# Altium schematic sheet coil_if.SchDoc: =ProjectName+'_'+ProjectRevision+'_'+VariantName
size A3; DocumentNumber: 3; SheetNumber: 3; SheetTotal: 5
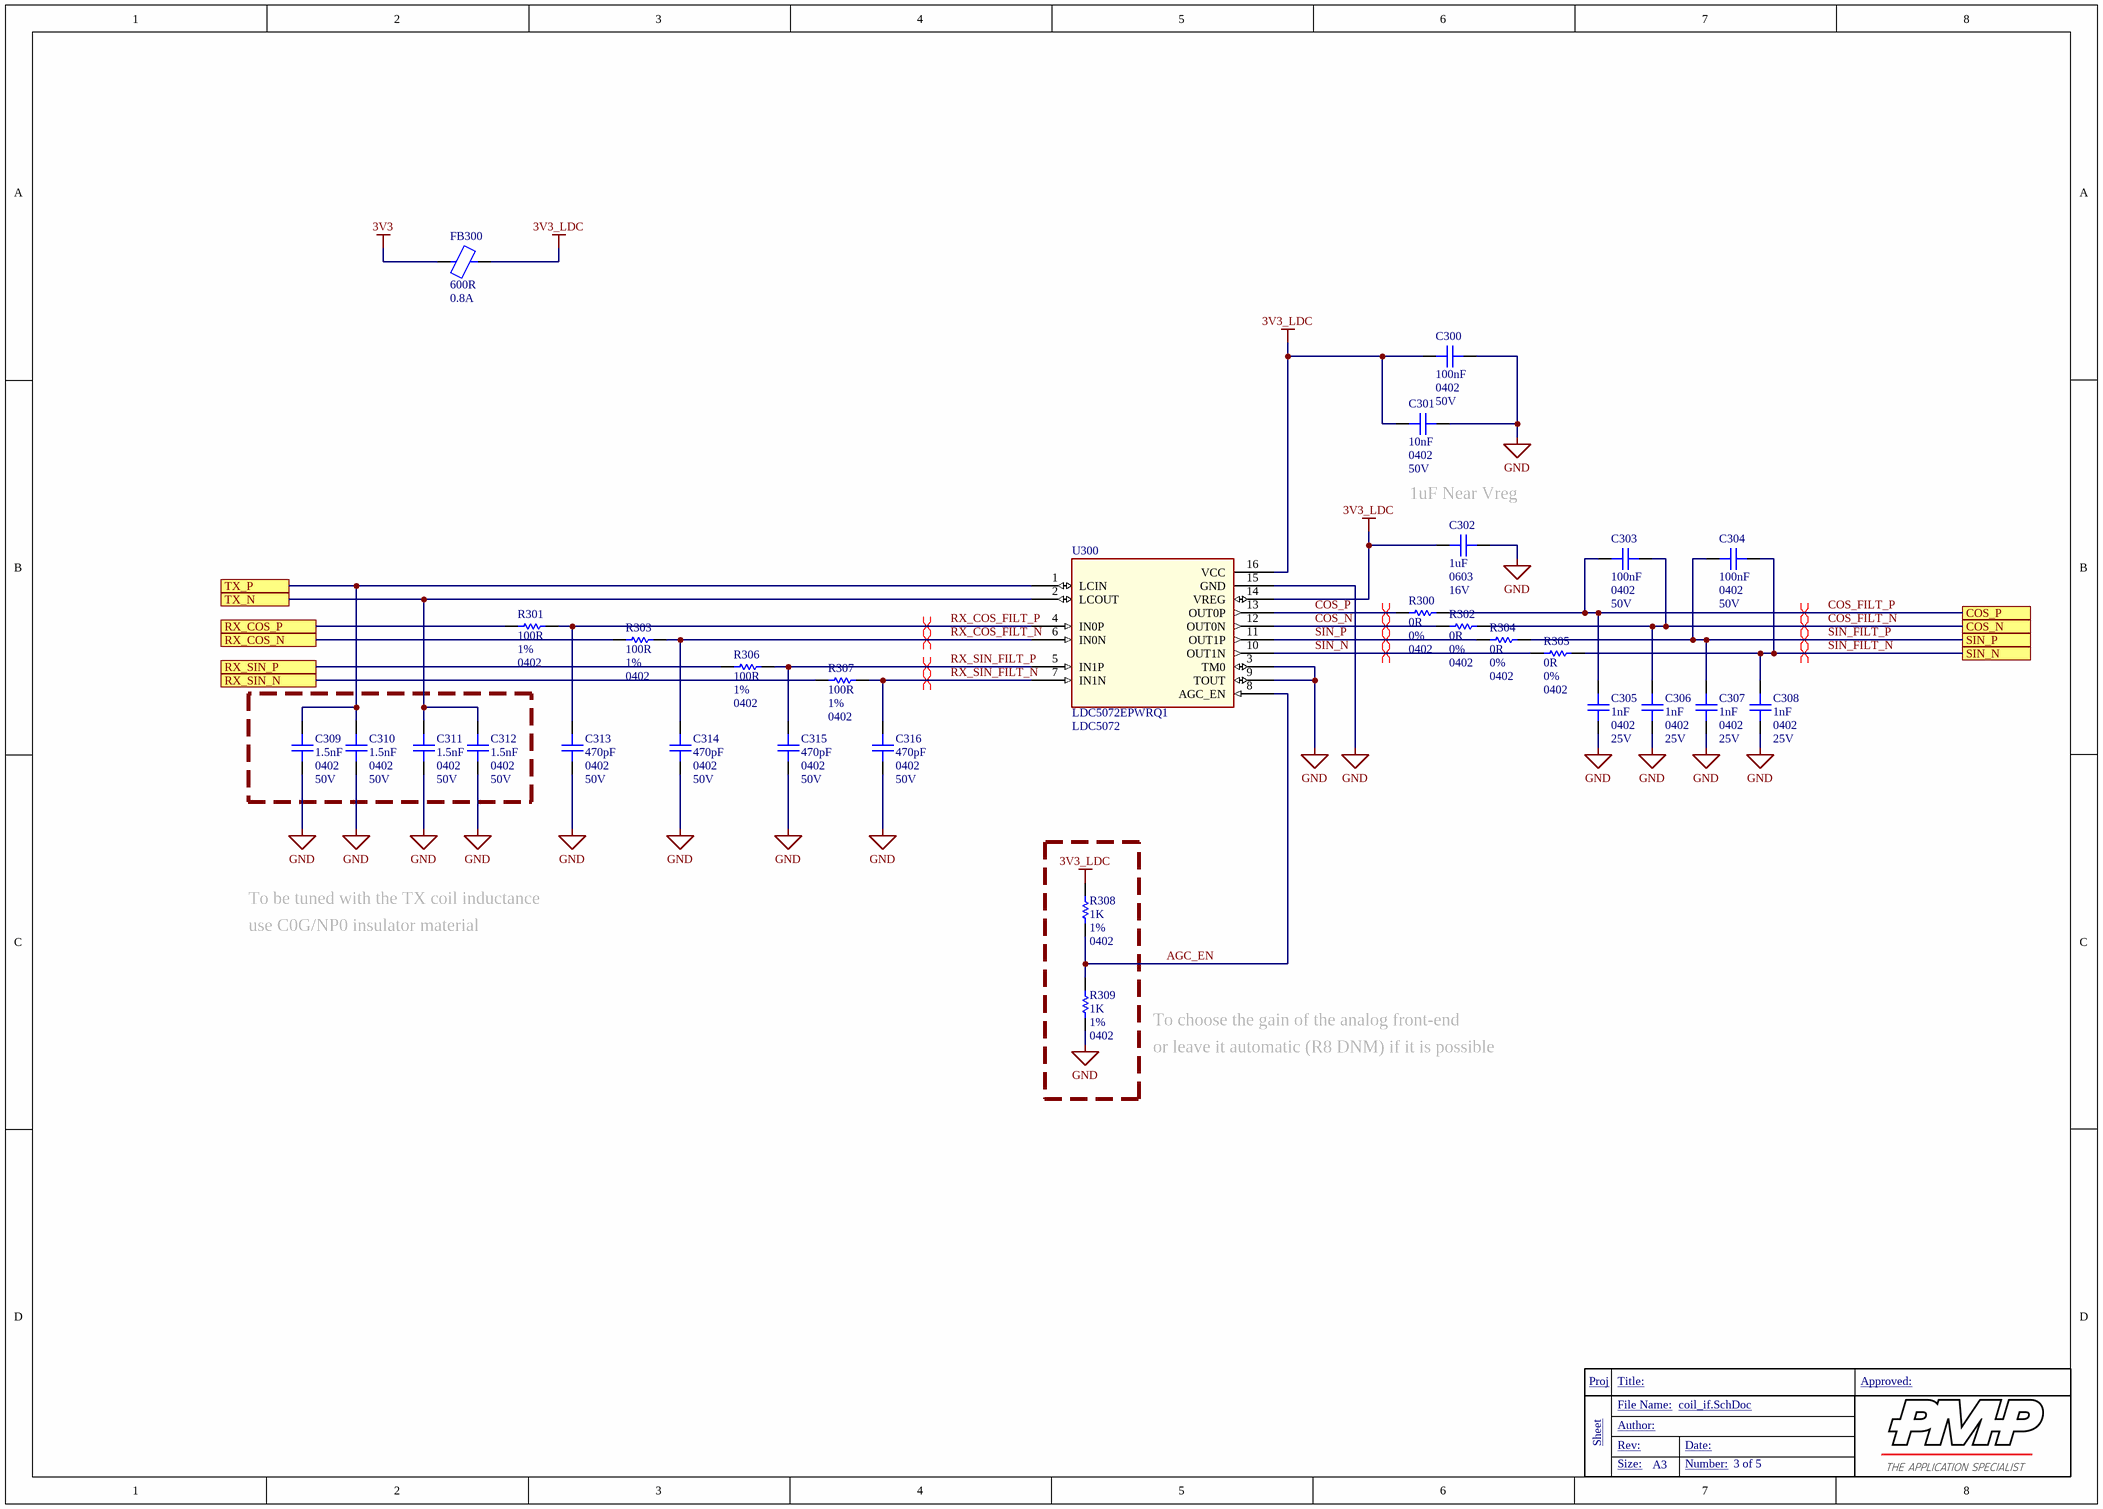
[diagram p0: coil_if.SchDoc]

## Parts
C300  Case/Package: 0402  Op Voltage: 50V  [CER0402]  (hidden comment: 100nF)
C301  Case/Package: 0402  Op Voltage: 50V  [CER0402]  (hidden comment: 10nF)
C302  Case/Package: 0603  Op Voltage: 16V  [CER0603]  (hidden comment: 1uF)
C303  Case/Package: 0402  Op Voltage: 50V  [CER0402]  (hidden comment: 100nF)
C304  Case/Package: 0402  Op Voltage: 50V  [CER0402]  (hidden comment: 100nF)
C305  Case/Package: 0402  Op Voltage: 25V  [CER0402]  (hidden comment: 1nF)
C306  Case/Package: 0402  Op Voltage: 25V  [CER0402]  (hidden comment: 1nF)
C307  Case/Package: 0402  Op Voltage: 25V  [CER0402]  (hidden comment: 1nF)
C308  Case/Package: 0402  Op Voltage: 25V  [CER0402]  (hidden comment: 1nF)
C309  Case/Package: 0402  Op Voltage: 50V  [CER0402]  (hidden comment: 1.5nF)
C310  Case/Package: 0402  Op Voltage: 50V  [CER0402]  (hidden comment: 1.5nF)
C311  Case/Package: 0402  Op Voltage: 50V  [CER0402]  (hidden comment: 1.5nF)
C312  Case/Package: 0402  Op Voltage: 50V  [CER0402]  (hidden comment: 1.5nF)
C313  Case/Package: 0402  Op Voltage: 50V  [CER0402]  (hidden comment: 470pF)
C314  Case/Package: 0402  Op Voltage: 50V  [CER0402]  (hidden comment: 470pF)
C315  Case/Package: 0402  Op Voltage: 50V  [CER0402]  (hidden comment: 470pF)
C316  Case/Package: 0402  Op Voltage: 50V  [CER0402]  (hidden comment: 470pF)
FB300  Impedence @100MHz: 600R  Rated Current @85°C: 0.8A  [FEB0603]
R300  value 0R  Tolerance: 0%  Case/Package: 0402  [Res0402]  (hidden comment: SMD Resistor)
R301  value 100R  Tolerance: 1%  Case/Package: 0402  [Res0402]  (hidden comment: SMD Resistor)
R302  value 0R  Tolerance: 0%  Case/Package: 0402  [Res0402]  (hidden comment: SMD Resistor)
R303  value 100R  Tolerance: 1%  Case/Package: 0402  [Res0402]  (hidden comment: SMD Resistor)
R304  value 0R  Tolerance: 0%  Case/Package: 0402  [Res0402]  (hidden comment: SMD Resistor)
R305  value 0R  Tolerance: 0%  Case/Package: 0402  [Res0402]  (hidden comment: SMD Resistor)
R306  value 100R  Tolerance: 1%  Case/Package: 0402  [Res0402]  (hidden comment: SMD Resistor)
R307  value 100R  Tolerance: 1%  Case/Package: 0402  [Res0402]  (hidden comment: SMD Resistor)
R308  value 1K  Tolerance: 1%  Case/Package: 0402  [Res0402]  (hidden comment: SMD Resistor)
R309  value 1K  Tolerance: 1%  Case/Package: 0402  [Res0402]  (hidden comment: SMD Resistor)
U300  LDC5072EPWRQ1  value LDC5072  [TSSOP16-PW_TEX]

## Ports
COS_N, COS_P, RX_COS_N, RX_COS_P, RX_SIN_N, RX_SIN_P, SIN_N, SIN_P, TX_N, TX_P

## Nets
3V3: FB300.1
3V3_LDC: C300.1 C301.1 C302.1 FB300.2 R308.2 U300.14(VREG) U300.16(VCC)
GND: C300.2 C301.2 C302.2 C305.2 C306.2 C307.2 C308.2 C309.2 C310.2 C311.2 C312.2 C313.2 C314.2 C315.2 C316.2 R309.1 U300.3(TM0) U300.9(TOUT) U300.15(GND)
AGC_EN: R308.1 R309.2 U300.8(AGC_EN)
COS_FILT_N: C303.1 C306.1 R302.2 ; port COS_N
COS_FILT_P: C303.2 C305.1 R300.2 ; port COS_P
COS_N: R302.1 U300.12(OUT0N)
COS_P: R300.1 U300.13(OUT0P)
RX_COS_FILT_N: C314.1 R303.2 U300.6(IN0N)
RX_COS_FILT_P: C313.1 R301.2 U300.4(IN0P)
RX_COS_N: R303.1 ; port RX_COS_N
RX_COS_P: R301.1 ; port RX_COS_P
RX_SIN_FILT_N: C316.1 R307.2 U300.7(IN1N)
RX_SIN_FILT_P: C315.1 R306.2 U300.5(IN1P)
RX_SIN_N: R307.1 ; port RX_SIN_N
RX_SIN_P: R306.1 ; port RX_SIN_P
SIN_FILT_N: C304.1 C308.1 R305.2 ; port SIN_N
SIN_FILT_P: C304.2 C307.1 R304.2 ; port SIN_P
SIN_N: R305.1 U300.10(OUT1N)
SIN_P: R304.1 U300.11(OUT1P)
TX_N: C311.1 C312.1 U300.2(LCOUT) ; port TX_N
TX_P: C309.1 C310.1 U300.1(LCIN) ; port TX_P

## Layout directives
differential pair: COS_FILT_N, COS_FILT_P, COS_N, COS_P, RX_COS_FILT_N, RX_COS_FILT_P, RX_SIN_FILT_N, RX_SIN_FILT_P, SIN_FILT_N, SIN_FILT_P, SIN_N, SIN_P

## Notes on the sheet
- 1uF Near Vreg
- To be tuned with the TX coil inductance
- use C0G/NP0 insulator material
- To choose the gain of the analog front-end
- or leave it automatic (R8 DNM) if it is possible
- Proj
- Title:
- Approved:
- Sheet
- File Name:
- Rev:
- Author:
- Date:
- Size:
- A3
- Number:

## Library data of the parts
C300 C303 C304 = GCM155R71H104KE02D: MLCC Automotive, 100nF, 0402, 50V, 10%, X7r; MFG1: MURATA; Min Op# Temp °C: -55; Max Op# temp °C: 125; Qualification: AEC-Q200; MPN1: GCM155R71H104KE02D; Value: 100nF; MFG2: MURATA; MPN2: GCM155R71H104KE37; Tolerance: 10%; Dielectric: X7R; Supplier: Mouser; Supplier Part Number: 81-GCM155R71H104KE2D; Supplier URL: https://www.mouser.it/ProductDetail/Murata-Electronics/GCM155R71H104KE02D?qs=hNud%2FORuBR2sLZsqfoz4Fw%3D%3D; Datasheet URL: https://www.mouser.it/datasheet/2/281/1/GCM155R71H104KE02_01A-3142168.pdf; Technology: Powertrain/Safety for Automotive
C301 = GCM155R71H103KA55*: MLCC Automotive, 10nF, 0402, 25V, 10%, X7r; MFG1: MURATA; Min Op# Temp °C: -55; Max Op# temp °C: 125; Qualification: AEC-Q200; MPN1: GCM155R71H103KA55*; Value: 10nF; Tolerance: 10%; Dielectric: X7R; Supplier: Mouser; Supplier Part Number: 81-GCM155R71H103KA5J; Supplier URL: https://www.mouser.it/ProductDetail/Murata-Electronics/GCM155R71H103KA55J?qs=N3Kl9KD794RolAwdnyzU1Q%3D%3D; Datasheet URL: https://www.mouser.it/datasheet/2/281/1/GCM155R71H103KA55_01A-3142380.pdf; Technology: Powertrain/Safety for Automotive
C302 = GCM188R71C105KA64J: MLCC Automotive, 1uF, 0603, 16V, 10%, X7R; MFG1: MURATA; Min Op# Temp °C: -55; Max Op# temp °C: 125; Qualification: AEC-Q200; MPN1: GCM188R71C105KA64J; Value: 1uF; MFG2: KEMET; MPN2: C0603C105K4RACAUTO; Tolerance: 10%; Dielectric: X7R; Supplier: Mouser; Supplier Part Number: 81-GCM188R71C105KA4J; Supplier URL: https://www.mouser.it/ProductDetail/Murata-Electronics/GCM188R71C105KA64J?qs=4%252BGqC78dy0BN5WaW5TLgXw%3D%3D; Datasheet URL: https://www.mouser.it/datasheet/2/281/1/GCM188R71C105KA64_04A-3143889.pdf; Technology: Powertrain/Safety for Automotive
C305-C308 = GRT1555C1E102JA02J: MLCC Automotive, 1nF, 0402, 25V, 10%, COG; MFG1: MURATA; Tolerance: 5%; Dielectric: C0G; Min Op# Temp °C: -55; Max Op# temp °C: 125; Qualification: AEC-Q200; MPN1: GRT1555C1E102JA02J; Value: 1nF; Supplier: Mouser; Supplier Part Number: 81-GRT1555C1E102JA2J; Supplier URL: https://www.mouser.it/it/ProductDetail/Murata-Electronics/GRT1555C1E102JA02J?qs=sGAEpiMZZMvsSlwiRhF8qtsGU%2FCnaNeQokeRzBpVly3nnJVQ2ndM9w%3D%3D; Datasheet URL: https://www.mouser.it/datasheet/3/76/4/GRT1555C1E102JA02_01A.pdf
C309-C312 = C0402C152J5GECAUTO: MLCC Automotive, 1.5nF, 0402, 50V, 5%, COG; MFG1: KEMET; Min Op# Temp °C: -55; Max Op# temp °C: 125; Qualification: AEC-Q200; MPN1: C0402C152J5GECAUTO; Value: 1.5nF; Tolerance: 5%; Dielectric: COG; Supplier: Mouser; Supplier Part Number: 80-C0402C152J5GECAUT; Supplier URL: https://www.mouser.it/it/ProductDetail/KEMET/C0402C152J5GECAUTO?qs=sGAEpiMZZMvsSlwiRhF8qtsBU8Zhqm2RstfWlm%252B2k5Aa%2FmzJukmmdw%3D%3D
C313-C316 = GCM1555C1H471JA16: MLCC Automotive, 470pF, 0402, 50V, 5%, COG; MFG1: MURATA; Min Op# Temp °C: -55; Max Op# temp °C: 125; Qualification: AEC-Q200; MPN1: GCM1555C1H471JA16; Value: 470pF; Tolerance: 5%; Dielectric: COG; Supplier: Mouser; Supplier Part Number: 81-GCM1555C1H471JA6J; Supplier URL: https://www.mouser.it/ProductDetail/Murata-Electronics/GCM1555C1H471JA16J?qs=N3Kl9KD794TXvw4%2Fs7azFA%3D%3D; Technology: Powertrain/Safety for Automotive
FB300 = BLM18HE601SH1D: SMD EMI Suppression Ferrite Bead 600R, 0603, For DC Power; MFG1: MURATA; Rated Current @125°C: 0.6A; DCR (mR): 125; Min Op# Temp °C: -55; MPN1: BLM18HE601SH1D; Impedence @1GHz: 600R; Case/Package: 0603; Supplier: Mouser; Supplier Part Number: 81-BLM18HE601SH1D; Supplier URL: https://www.mouser.it/ProductDetail/Murata-Electronics/BLM18HE601SH1D?qs=d0WKAl%252BL4KZJDOgHon8ecQ%3D%3D; Datasheet URL: https://www.murata.com/products/productdata/8796199452702/QNFA9104.pdf?1539737628000; Max Op# temp °C: 125; Technology: AEC-Q200
R300 R302 R304 R305 = CRCW04020000Z0ED: Thick Film SM Chip Resistors, 0R, 0402, 1/16W; MFG1: VISHAY; Power: 63mW; Temp# Coeffiient (PPM/C): 0; Min Op# Temp °C: -55; Max Op# temp °C: 155; Qualification: AEC-Q200; MPN1: CRCW04020000Z0ED; Supplier: Mouser; Supplier Part Number: 71-CRCW0402-0-E3; Supplier URL: https://www.mouser.it/ProductDetail/Vishay-Dale/CRCW04020000Z0ED?qs=OlqPY1Ciranv3qgeAHCodg%3D%3D; Datasheet URL: https://www.vishay.com/docs/20035/dcrcwe3.pdf; Technology: Thick Film
R301 R303 R306 R307 = CRCW0402100RFKED: Thick Film SM Chip Resistors, 100R, 0402, ±1%, 1/16W; MFG1: VISHAY; Power: 63mW; Temp# Coeffiient (PPM/C): 100; Min Op# Temp °C: -55; Max Op# temp °C: 155; Qualification: AEC-Q200; MPN1: CRCW0402100RFKED; Supplier: Mouser; Supplier Part Number: 71-CRCW0402-100-E3; Supplier URL: https://www.mouser.it/ProductDetail/Vishay-Dale/CRCW0402100RFKED?qs=OlqPY1CiralT1EG%2F62gJpQ%3D%3D; Datasheet URL: https://www.vishay.com/docs/20035/dcrcwe3.pdf; Technology: Thick Film
R308 R309 = CRCW04021K00FKED: Thick Film SM Chip Resistors, 1K, 0402, ±1%, 1/16W; MFG1: VISHAY; Power: 63mW; Temp# Coeffiient (PPM/C): 100; Min Op# Temp °C: -55; Max Op# temp °C: 155; Qualification: AEC-Q200; MPN1: CRCW04021K00FKED; Supplier: Mouser; Supplier Part Number: 71-CRCW0402-1.0K-E3; Supplier URL: https://www.mouser.it/ProductDetail/Vishay-Dale/CRCW04021K00FKED?qs=YX%252BK5oaHNYqQ2WK%252BIAW12A%3D%3D; Technology: Thick Film
U300 = LDC5072EPWRQ1: IPS interface IC; Manufacturer_Name: Texas Instruments; MFG1: TI; Min Op# Temp °C: -40; Max Op# temp °C: 160; Qualification: AEC-Q100; Type: Specialized Sensors; Copyright: Copyright (C) 2026 Ultra Librarian. All rights reserved.; Manufacturer_Part_Number: LDC5072EPWRQ1; RefDes: RefDes; MPN1: LDC5072EPWRQ1; Case/Package: TSSOP-16; Supplier: Mouser; Supplier Part Number: 595-LDC5072EPWRQ1; Supplier URL: https://www.mouser.it/it/ProductDetail/Texas-Instruments/LDC5072EPWRQ1?qs=GBLSl2AkiruyHDEJhswGzQ%3D%3D; Datasheet URL: https://www.ti.com/lit/ds/symlink/ldc5072-q1.pdf?ts=1784869376494&ref_url=https%253A%252F%252Fwww.ti.com%252Fproduct%252FLDC5072-Q1